# Altium schematic sheet Heartrate_Monitor_External.SchDoc: Heart Rate Monitor External
size A4; DocumentNumber: 10; SheetNumber: 10; SheetTotal: 31
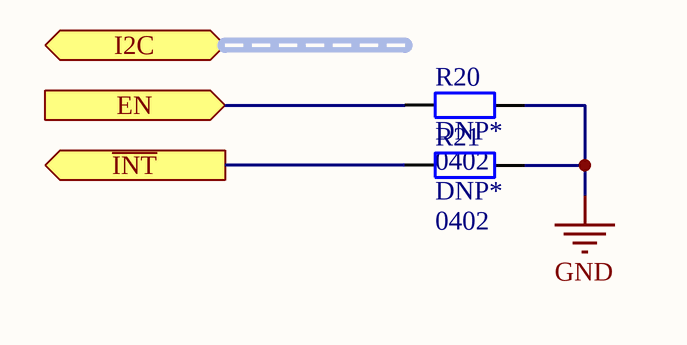
[diagram p0: Heartrate_Monitor_External.SchDoc]

## Parts
R20  DNP*  Case/Package: 0402  [0402R]  (no BOM)
R21  DNP*  Case/Package: 0402  [0402R]  (no BOM)

## Ports
EN (in), I2C (harness I2C), ~{INT} (out)

## Nets
GND: R20.1 R21.1
~{INT}: R21.2 ; port ~{INT}
EN: R20.2 ; port EN

## Notes on the sheet
- Title
- Size:
- Date:
- A4
- Number:
- Time:
- Revision:
- Sheet
- of
- File:

## Library data of the parts
R20 R21 = RES SMD NO BOM 0402: Placeholder for a 0402 resistor